# EAGLE design laserdot (EAGLE 7.7.0)
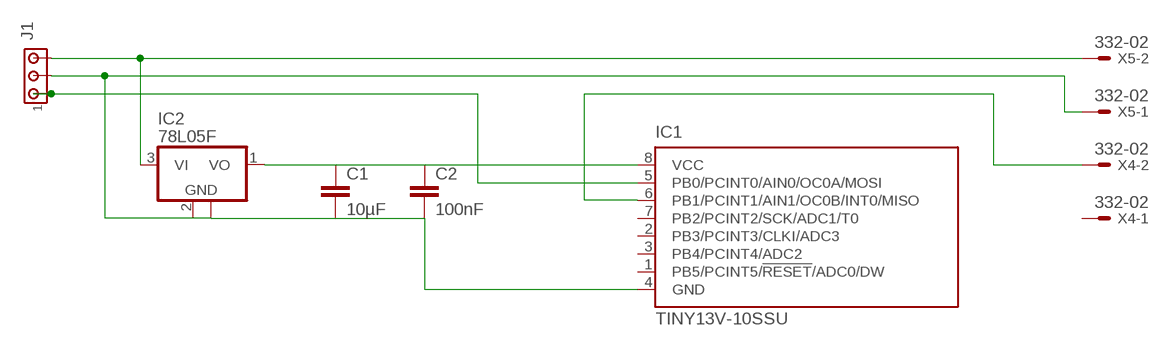
[diagram p0: schematic, sheet 1]

## Parts
C1  10µF  C-EUC0805  [C0805]
C2  100nF  C-EUC0805  [C0805]
IC1  TINY13V-10SSU  [8S1]
IC2  78L05F  [SOT89]
J1  MTA03-100  [10X03MTA]
X4  332-02  [332-02]
X5  332-02  [332-02]

## Nets
N$1: IC2.3(VI) J1.3 X5.2
N$2: C1.2 C2.2 IC1.4(GND) IC2.2(GND) IC2.2@1(GND) J1.2 X5.1
N$3: IC1.5(PB0/PCINT0/AIN0/OC0A/MOSI) J1.1
N$4: C1.1 C2.1 IC1.8(VCC) IC2.1(VO)
N$5: IC1.6(PB1/PCINT1/AIN1/OC0B/INT0/MISO) X4.2
Unconnected: IC1.1(PB5/PCINT5/!RESET!/ADC0/DW) IC1.2(PB3/PCINT3/CLKI/ADC3) IC1.3(PB4/PCINT4/ADC2) IC1.7(PB2/PCINT2/SCK/ADC1/T0) X4.1

## Library data of the parts
C1 C2 = rcl:C-EU: CAPACITOR, European symbol
IC1 = atmel:TINY13: 8-bit AVR Microcontroller with 1K Bytes In-System Programmable Flash Source: http://www.atmel.com/dyn/resources/prod_documents/2535S.pdf; MPN: ATTINY13V-10SSU; OC_FARNELL: 1455135; OC_NEWARK: 58M3773
IC2 = linear:78L*: POSITOIV-VOLTAGE REGULATORS Output up to 100 mA Source: Datasheet <http://focus.ti.com/lit/ds/symlink/ua78l05.pdf>
J1 = con-amp:MTA03-100: AMP connector
X4 X5 = con-garry:332-02: 2 Pin - 2mm Dual Row Source: www.mpe-connector.de / garry_shortform_2012.pdf

## Board
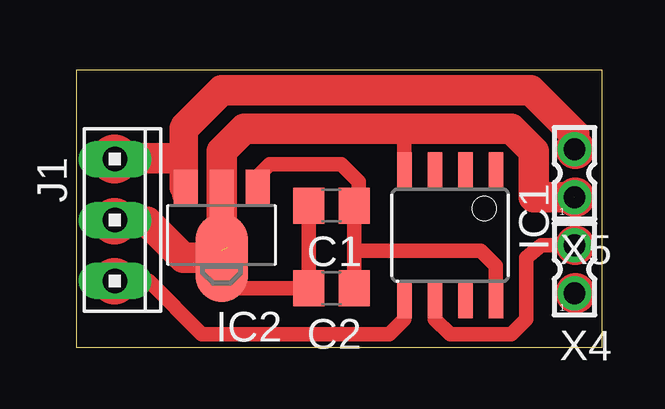
[diagram p1: board, top side]

Size 21.91 x 11.53 mm. Coordinates in mm from the lower left corner, seen from the top.
Outline: 0,0 21.91,0 21.91,11.53 0,11.53 0,0
Copper layers (1*16): Top 0.035mm / dielectric 1.5mm / Bottom 0.035mm
Design rules "default": minimum track width 10mil, minimum drill 24mil, track to track 8mil, track to pad 8mil, pad to pad 8mil, via to via 8mil, smd to smd 8mil, copper to edge 40mil, drill to drill 8mil, minimum pad ring 10mil, minimum via ring 8mil, stop-mask expansion 4mil, vias tented up to drill 0mil, thermal gap 10mil

### Footprints (pad centres in the part's own frame; a part is rotated, then mirrored left to right if it is on the bottom)
C0805 = smd 1.3 x 1.5: 1 -0.95,0; 2 0.95,0
8S1 = smd 0.6 x 1.6: 1 -1.905,-2.654; 2 -0.645,-2.654; 3 0.625,-2.654; 4 1.895,-2.654; 5 1.905,2.654; 6 0.635,2.654; 7 -0.635,2.654; 8 -1.905,2.654
SOT89 = smd 1 x 1.5: 1 -1.499,-1.981; 3 1.499,-1.981 | smd 1 x 2: 2 0,-1.727 | smd 2.2 x 3.7: 2@1 0,0.94
10X03MTA = drill 1.016 long: 1 2.54,0; 2 0,0; 3 -2.54,0
332-02 = drill 0.9 pad 1.27: 1 0,-1; 2 0,1

### Placement (x,y rotation side)
C1  10.63,5.9 180 top
C2  10.63,2.46 180 top
IC1  15.57,4.66 180 top
IC2  6.05,4.66 180 top
J1  1.6,5.3 270 top
X4  20.75,3.25 0 top
X5  20.75,7.25 0 top

### Tracks (layer width: path | path; a pad name or v marks a point on that pad's centre or on a via)
N$1
  Top 0.254: 1.15,7.74 J1.3
  Top 1.016: 1.15,7.74 1.4,7.88 | 4.55,9.2 IC2.3 4.39,6.64 4.39,7.95 | X5.2 20.75,8.88 | 4.39,7.95 4.39,7.88 4.35,7.88 1.49,7.88 | 4.39,7.95 4.49,7.95 4.49,6.35 | 4.39,9.15 4.39,7.95
  Top 1.27: 1.4,7.88 1.49,7.88 4.35,7.88 | 4.55,9.2 6.05,10.7 18.94,10.7 20.75,8.88
N$2  (2 unrouted)
  Top 0.254: 1.15,5.22 J1.2
  Top 0.406: IC1.4
  Top 0.61: C1.2 C2.2 6.02,2.46 6.05,4.03 | IC1.4 13.67,9.11
  Top 1.016: IC2.2 IC2.2@1 | 6.05,6.45 6.09,6.45 6.09,6.25 5.99,6.25 5.99,4.05 5.89,4.05 5.89,4.15 6.29,4.15
  Top 1.27: IC2.2 6.05,8.15 7,9.11 13.67,9.11 18.12,9.11 19.07,8.15 19.07,6.25 X5.1 | 1.15,5.22 2.95,5.22 4.45,3.72 IC2.2@1 6.05,6.45
N$3
  Top 0.406: IC1.5 13.67,1.17
  Top 0.61: J1.1 3.01,2.76 5.23,0.53 13.04,0.53 13.67,1.17
N$4
  Top 0.406: IC2.1 7.55,7.11 | 11.77,5.48 C1.1
  Top 0.61: 7.55,7.11 8.05,7.62 11.03,7.62 11.77,6.88 11.77,5.48 | C1.1 11.58,4.03 | 11.58,4.03 C2.1 | IC1.8 17.48,3.39 16.84,4.03 11.58,4.03
N$5
  Top 0.406: IC1.6 14.94,1.17
  Top 0.61: 14.94,1.17 15.57,0.53 18.12,0.53 18.75,1.17 18.75,3.73 19.37,4.24 X4.2
(copper drawn outside any net)
  shapes: Top circle x7